# Altium schematic sheet outdoor_plata.SchDoc
size A4
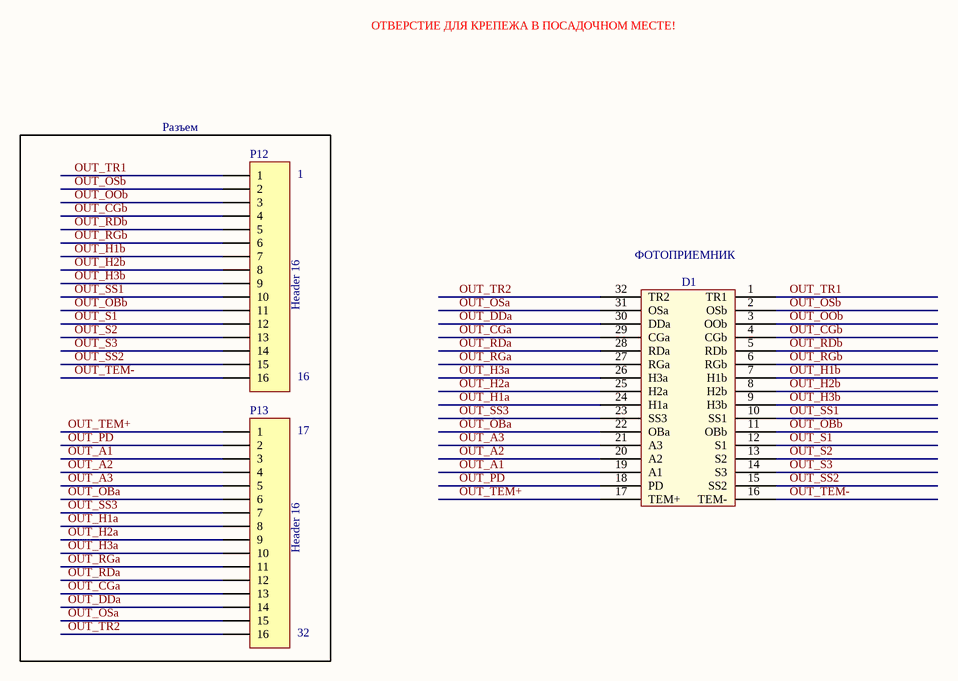
[diagram p0: outdoor_plata.SchDoc]

## Parts
D1  FPPZ 1024M  [FPPZ_1024M]  (value not drawn)
P12  Header 16  [HDR1X16]
P13  Header 16  [HDR1X16]

## Nets
OUT_A1: D1.19(A1) P13.3
OUT_A2: D1.20(A2) P13.4
OUT_A3: D1.21(A3) P13.5
OUT_CGa: D1.29(CGa) P13.13
OUT_CGb: D1.4(CGb) P12.4
OUT_DDa: D1.30(DDa) P13.14
OUT_H1a: D1.24(H1a) P13.8
OUT_H1b: D1.7(H1b) P12.7
OUT_H2a: D1.25(H2a) P13.9
OUT_H2b: D1.8(H2b) P12.8
OUT_H3a: D1.26(H3a) P13.10
OUT_H3b: D1.9(H3b) P12.9
OUT_OBa: D1.22(OBa) P13.6
OUT_OBb: D1.11(OBb) P12.11
OUT_OOb: D1.3(OOb) P12.3
OUT_OSa: D1.31(OSa) P13.15
OUT_OSb: D1.2(OSb) P12.2
OUT_PD: D1.18(PD) P13.2
OUT_RDa: D1.28(RDa) P13.12
OUT_RDb: D1.5(RDb) P12.5
OUT_RGa: D1.27(RGa) P13.11
OUT_RGb: D1.6(RGb) P12.6
OUT_S1: D1.12(S1) P12.12
OUT_S2: D1.13(S2) P12.13
OUT_S3: D1.14(S3) P12.14
OUT_SS1: D1.10(SS1) P12.10
OUT_SS2: D1.15(SS2) P12.15
OUT_SS3: D1.23(SS3) P13.7
OUT_TEM+: D1.17(TEM+) P13.1
OUT_TEM-: D1.16(TEM-) P12.16
OUT_TR1: D1.1(TR1) P12.1
OUT_TR2: D1.32(TR2) P13.16

## Notes on the sheet
- ОТВЕРСТИЕ ДЛЯ КРЕПЕЖА В ПОСАДОЧНОМ МЕСТЕ!
- Разъем
- (near P12) 1
- (near D1) ФОТОПРИЕМНИК
- 16
- 17
- (near P13) 32

## Library data of the parts
P12 P13 = Header 16: Header, 16-Pin; LatestRevisionDate: 17-Jul-2002; LatestRevisionNote: Re-released for DXP Platform.; Publisher: Altium Limited